# Altium schematic sheet MAIN_PCB_CONNECTOR.SchDoc
size A; SheetNumber: 2; SheetTotal: 4
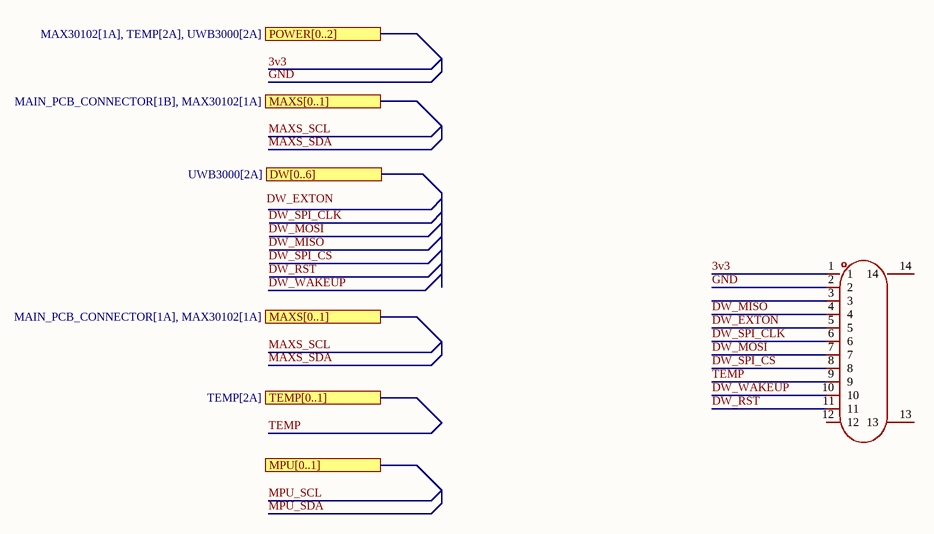
[diagram p0: MAIN_PCB_CONNECTOR.SchDoc]

## Parts
FPC1  FH12-12S-0.5SH(55)  [FPC-SMD_FH12-12S-0.5SH-55]  (value not drawn)

## Ports
DW[0..6] (see UWB3000[2A]), MAXS[0..1] (see MAIN_PCB_CONNECTOR[1A], MAX30102[1A]), MAXS[0..1] (see MAIN_PCB_CONNECTOR[1B], MAX30102[1A]), MPU[0..1], POWER[0..2] (see MAX30102[1A], TEMP[2A], UWB3000[2A]), TEMP[0..1] (see TEMP[2A])

## Nets
3v3: FPC1.1
DW_EXTON: FPC1.5
DW_MISO: FPC1.4
DW_MOSI: FPC1.7
DW_RST: FPC1.11
DW_SPI_CLK: FPC1.6
DW_SPI_CS: FPC1.8
DW_WAKEUP: FPC1.10
GND: FPC1.2
TEMP: FPC1.9

Not connected (* = marked no-connect by the designer): FPC1 3 12 13 14

## Notes on the sheet
- Labels drawn without touching a wire or pin: DW_EXTON, DW_MISO, DW_MOSI, DW_RST, DW_SPI_CLK, DW_SPI_CS

## Library data of the parts
FPC1 = FH12-12S-0.5SH(55): Manufacturer: HRS(Hirose); MFR.Part #: FH12-12S-0.5SH(55); JLCPCB Part #: C88360